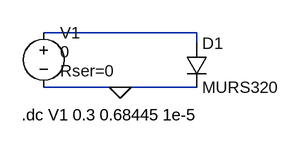
[diagram p0: schematic questao1.asc]
questao1.asc, the LTspice schematic file:
Version 4
SHEET 1 880 680
WIRE 224 -16 0 -16
WIRE 224 0 224 -16
WIRE 112 64 0 64
WIRE 224 64 112 64
FLAG 112 64 0
SYMBOL diode 208 0 R0
SYMATTR InstName D1
SYMATTR Value MURS320
SYMBOL voltage 0 -32 R0
WINDOW 3 24 44 Left 2
WINDOW 123 0 0 Left 0
WINDOW 39 24 72 Left 2
SYMATTR Value 0
SYMATTR SpiceLine Rser=0
SYMATTR InstName V1
TEXT -32 104 Left 2 !.dc V1 0.3 0.68445 1e-5

The netlist it stands for:
* questao1.asc
D1 N001 0 MURS320
V1 N001 0 0 Rser=0
.model D D
.lib standard.dio
.dc V1 0.3 0.68445 1e-5
.backanno
.end